# EAGLE design 2.3c (EAGLE 9.6.2)
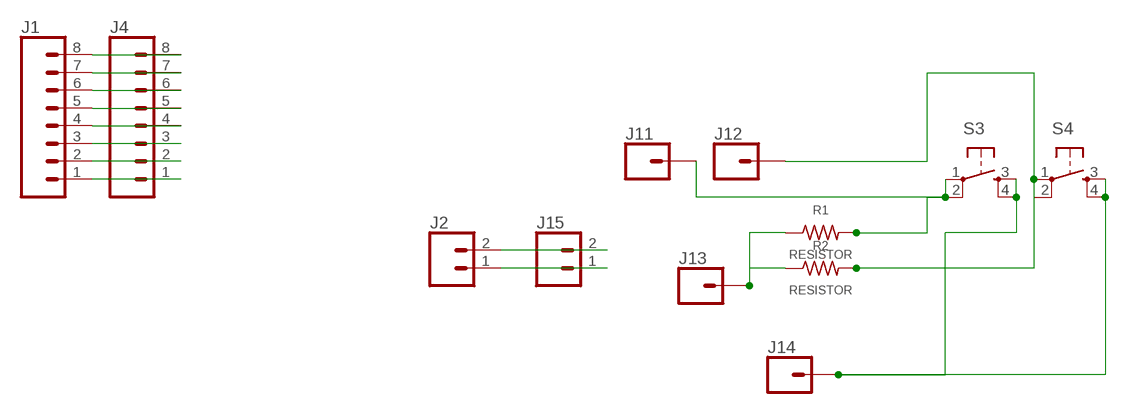
[diagram p0: schematic, sheet 1]

## Parts
J1  CONN_08"  [1X08]
J2  CONN_02  [1X02]
J4  CONN_08"  [1X08]
J11  CONN_01  [1X01]
J12  CONN_01  [1X01]
J13  CONN_01  [1X01]
J14  CONN_01  [1X01]
J15  CONN_02  [1X02]
R1  RESISTOR  [0207/10]
R2  RESISTOR  [0207/10]
S3  TAC_SWITCHPTH  [TACTILE-PTH]
S4  TAC_SWITCHPTH  [TACTILE-PTH]

## Nets
N$1: J11.1 R1.2 S3.1 S3.2
N$3: J13.1 R1.1 R2.1
N$6: J2.2 J15.2
N$7: J2.1 J15.1
N$15: J1.1 J4.1
N$16: J1.2 J4.2
N$17: J1.3 J4.3
N$18: J1.4 J4.4
N$19: J1.5 J4.5
N$20: J1.6 J4.6
N$21: J1.7 J4.7
N$22: J1.8 J4.8
N$24: J12.1 R2.2 S4.1 S4.2
N$25: J14.1 S3.3 S3.4 S4.3 S4.4

## Library data of the parts
J1 J4 = SparkFun-Connectors:CONN_08: Multi connection point. Often used as Generic Header-pin footprint for 0.1 inch spaced/style header connections On any of the 0.1 inch spaced packages, you can populate with these: Break Away Headers - Straight <https://www.sparkfun.com/products/116> (PRT-00116) Break Away Male Headers - Right Angle <https://www.sparkfun.com/products/553> (PRT-00553) Female Headers <https://www.sparkfun.com/products/115> (PRT-00115) Break Away Headers - Machine Pin <https://www.sparkfun.com/products/117> (PRT-00117) Break Away Female Headers - Swiss Machine Pin <https://www.sparkfun.com/products/743> (PRT-00743) Arduino Stackable Header - 8 Pin <https://www.sparkfun.com/products/9279> (PRT-09279) For SCREWTERMINALS and SPRING TERMINALS visit here: Screw Terimnals on SparkFun.com <https://www.sparkfun.com/search/results?term=Screw+Terminals> (5mm/3.5mm/2.54mm spacing) This device is also useful as a general connection point to wire up your design to another part of your project. Our various solder wires solder well into these plated through hole pads. Hook-Up Wire - Assortment (Stranded, 22 AWG) <https://www.sparkfun.com/products/11375> (PRT-11375) Hook-Up Wire - Assortment (Solid Core, 22 AWG) <https://www.sparkfun.com/products/11367> (PRT-11367) View the entire wire category on our website here <https://www.sparkfun.com/categories/141> Special notes: Molex polarized connector foot print use with SKU : PRT-08231 with associated crimp pins and housings. 1MM SMD Version SKU: PRT-10208 NOTES ON THE VARIANTS LOCK and LOCK_LONGPADS... This footprint was designed to help hold the alignment of a through-hole component (i.e. 6-pin header) while soldering it into place. You may notice that each hole has been shifted either up or down by 0.005 of an inch from it's more standard position (which is a perfectly straight line). This slight alteration caused the pins (the squares in the middle) to touch the edges of the holes. Because they are alternating, it causes a "brace" to hold the component in place. 0.005 has proven to be the perfect amount of "off-center" position when using our standard breakaway headers. Although looks a little odd when you look at the bare footprint, once you have a header in there, the alteration is very hard to notice. Also,if you push a header all the way into place, it is covered up entirely on the bottom side.; PROD_ID: CONN-08438
J2 J15 = SparkFun-Connectors:CONN_02: Multi connection point. Often used as Generic Header-pin footprint for 0.1 inch spaced/style header connections On any of the 0.1 inch spaced packages, you can populate with these: Break Away Headers - Straight <https://www.sparkfun.com/products/116> (PRT-00116) Break Away Male Headers - Right Angle <https://www.sparkfun.com/products/553> (PRT-00553) Female Headers <https://www.sparkfun.com/products/115> (PRT-00115) Break Away Headers - Machine Pin <https://www.sparkfun.com/products/117> (PRT-00117) Break Away Female Headers - Swiss Machine Pin <https://www.sparkfun.com/products/743> (PRT-00743) For SCREWTERMINALS and SPRING TERMINALS visit here: Screw Terimnals on SparkFun.com <https://www.sparkfun.com/search/results?term=Screw+Terminals> (5mm/3.5mm/2.54mm spacing) This device is also useful as a general connection point to wire up your design to another part of your project. Our various solder wires solder well into these plated through hole pads. Hook-Up Wire - Assortment (Stranded, 22 AWG) <https://www.sparkfun.com/products/11375> (PRT-11375) Hook-Up Wire - Assortment (Solid Core, 22 AWG) <https://www.sparkfun.com/products/11367> (PRT-11367) View the entire wire category on our website here <https://www.sparkfun.com/categories/141> Special notes: Molex polarized connector foot print use with: PRT-08233 with associated crimp pins and housings. 2.54_SCREWTERM for use with PRT-10571. 3.5mm Screw Terminal footprints for PRT-08084 5mm Screw Terminal footprints for use with PRT-08432
J11-J14 = SparkFun-Connectors:CONN_01: Single connection point. Often used as Generic Header-pin footprint for 0.1 inch spaced/style header connections On any of the 0.1 inch spaced packages, you can populate with these: Break Away Headers - Straight <https://www.sparkfun.com/products/116> (PRT-00116) Break Away Male Headers - Right Angle <https://www.sparkfun.com/products/553> (PRT-00553) Female Headers <https://www.sparkfun.com/products/115> (PRT-00115) Break Away Headers - Machine Pin <https://www.sparkfun.com/products/117> (PRT-00117) Break Away Female Headers - Swiss Machine Pin <https://www.sparkfun.com/products/743> (PRT-00743) This device is also useful as a general connection point to wire up your design to another part of your project. Our various solder wires solder well into these plated through hole pads. Hook-Up Wire - Assortment (Stranded, 22 AWG) <https://www.sparkfun.com/products/11375> (PRT-11375) Hook-Up Wire - Assortment (Solid Core, 22 AWG) <https://www.sparkfun.com/products/11367> (PRT-11367) View the entire wire category on our website here <https://www.sparkfun.com/categories/141> Special notes: SMTSO-256-ET is a "flush mount" nut for a 4-40 screw. We mostly use this on specialty testbeds; it is a nice way to connect hardware to your PCB at an adjustable hieght. Also note, the SNAP packages are for using a snappable style connector. We sell a baggie of snaps and they are also used on two LilyPad designs: Snap Assortment - 30 pack (male and female) <https://www.sparkfun.com/products/11347> (DEV-11347) LilyPad Arduino SimpleSnap <https://www.sparkfun.com/products/10941> (DEV-10941) LilyPad SimpleSnap Protoboard <https://www.sparkfun.com/products/10940> (DEV-10940)
R1 R2 = ACES_THT:RESISTOR: Based on rcl Libray part R-US_0207/10 with longer oval pads for easier hand soldering. Digikey Part #: 470QBK-ND <https://www.digikey.ca/products/en/resistors/through-hole-resistors/53?k=fixed+resistor&k=&pkeyword=fixed+resistor&sv=1&pv2=4&pv174=18&sf=0&FV=ffe00035%2Cfffc000d%2C1c0003%2C1f140000%2Cmu470+Ohms%7C2085&quantity=&ColumnSort=0&page=1&stock=1&pageSize=25>
S3 S4 = SparkFun-Retired:TAC_SWITCH: Momentary Switch Button commonly used for reset or general input. Spark Fun Electronics SKU : COM-00097 SMT- SWCH-08247

## Board
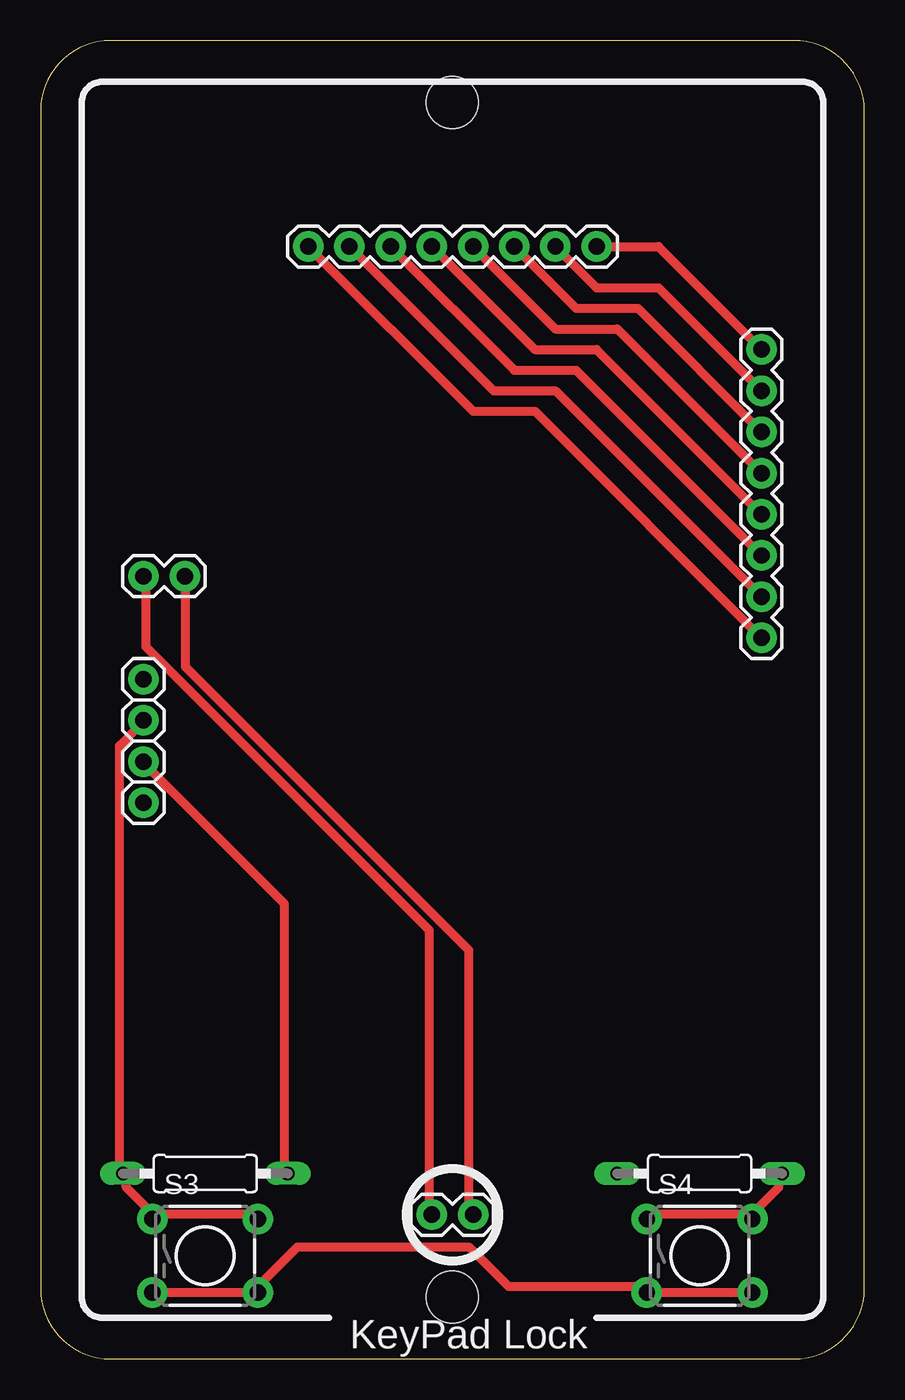
[diagram p1: board, top side]
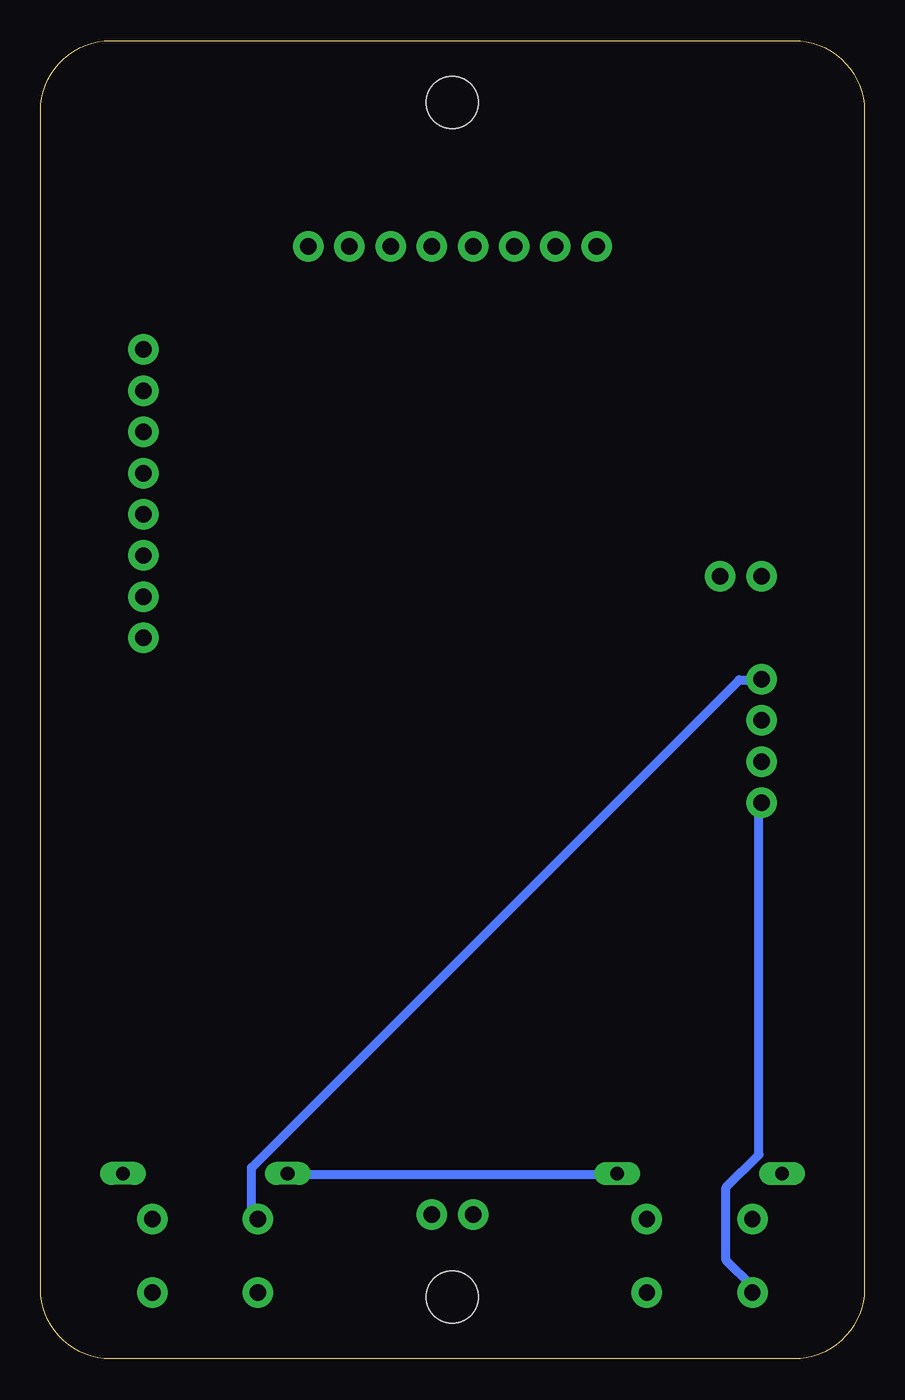
[diagram p2: board, bottom side, seen from below]

Size 50.8 x 81.28 mm. Coordinates in mm from the lower left corner, seen from the top.
Outline: 0,76.94 0,4.34 arc90 4.34,0 46.46,0 arc90 50.8,4.34 50.8,76.94 arc90 46.46,81.28 4.34,81.28 arc90 0,76.94
Copper layers (1*16): Top 0.035mm / dielectric 1.5mm / Bottom 0.035mm
Design rules "ACES_THT (1) *": minimum track width 22mil, minimum drill 0.35mm, track to track 10mil, track to pad 10mil, pad to pad 10mil, via to via 10mil, smd to smd 6mil, copper to edge 40mil, drill to drill 6mil, minimum pad ring 10mil, minimum via ring 8mil, stop-mask expansion 4mil, vias tented up to drill 0mil, thermal gap 10mil
Holes 3.2 mm at 25.4,3.81 25.4,77.47

### Footprints (pad centres in the part's own frame; a part is rotated, then mirrored left to right if it is on the bottom)
1X08 = drill 1.016 pad 1.88: 1 0,0; 2 2.54,0; 3 5.08,0; 4 7.62,0; 5 10.16,0; 6 12.7,0; 7 15.24,0; 8 17.78,0
1X02 = drill 1.016 pad 1.88: 1 0,0; 2 2.54,0
1X01 = drill 1.016 pad 1.88: 1 0,0
0207/10 = drill 0.85 pad 1.422 long: 1 -5.08,0; 2 5.08,0
TACTILE-PTH = drill 1.016 pad 1.88: 1 -3.251,2.261; 2 3.251,2.261; 3 -3.251,-2.261; 4 3.251,-2.261

### Placement (x,y rotation side)
J1  16.51,68.58 0 top
J2  24.13,8.89 0 top
J4  44.45,44.45 90 top
J11  6.35,39.37 0 top
J12  6.35,41.91 0 top
J13  6.35,36.83 0 top
J14  6.35,34.29 0 top
J15  6.35,48.26 0 top
R1  10.16,11.43 180 top
R2  40.64,11.43 0 top
S3  10.16,6.35 0 top
S4  40.64,6.35 0 top

### Tracks (layer width: path | path; a pad name or v marks a point on that pad's centre or on a via)
N$1
  Top 0.559: 6.91,8.94 5.28,10.57 5.28,11.38 R1.2 4.88,11.79 4.88,37.8 6.1,39.01 J11.1 | 6.91,8.94 13.41,8.94 S3.2 | 6.91,8.94 S3.1
N$3
  Top 0.559: J13.1 6.5,36.58 15.04,28.04 15.04,11.79 R1.1
  Bottom 0.559: R1.1 15.44,11.38 35.36,11.38 R2.1
N$6
  Top 0.559: J15.2 8.94,47.95 8.94,42.67 26.42,25.2 26.42,8.94 J2.2
N$7
  Top 0.559: J15.1 6.5,47.95 6.5,43.89 23.98,26.42 23.98,8.94 J2.1
N$15
  Top 0.559: J1.1 26.67,58.42 30.48,58.42 J4.1
N$16
  Top 0.559: J1.2 27.94,59.69 31.75,59.69 J4.2
N$17
  Top 0.559: J1.3 29.21,60.96 33.02,60.96 J4.3
N$18
  Top 0.559: J1.4 30.48,62.23 34.29,62.23 J4.4
N$19
  Top 0.559: J1.5 31.75,63.5 35.56,63.5 J4.5
N$20
  Top 0.559: J1.6 33.02,64.77 36.83,64.77 J4.6
N$21
  Top 0.559: J1.7 34.29,66.04 38.1,66.04 J4.7
N$22
  Top 0.559: J1.8 38.1,68.58 J4.8
N$24
  Top 0.559: 43.89,8.94 45.52,10.57 45.52,11.38 R2.2 | 43.89,8.94 37.39,8.94 S4.1 | 43.89,8.94 S4.2
  Bottom 0.559: J12.1 6.5,41.86 7.72,41.86 37.8,11.79 37.8,9.35 37.39,8.94 S4.1
N$25
  Top 0.559: S4.4 43.89,4.06 37.39,4.06 S4.3 37.39,4.47 28.85,4.47 26.42,6.91 15.85,6.91 13.41,4.47 S3.4 13.41,4.06 6.91,4.06 S3.3
  Bottom 0.559: J14.1 6.5,34.14 6.5,12.6 8.53,10.57 8.53,6.1 6.91,4.47 S3.3

### Text on the board
tPlace: KeyPad Lock